# EAGLE design uc4h esc mini v100 (EAGLE 7.5.0)
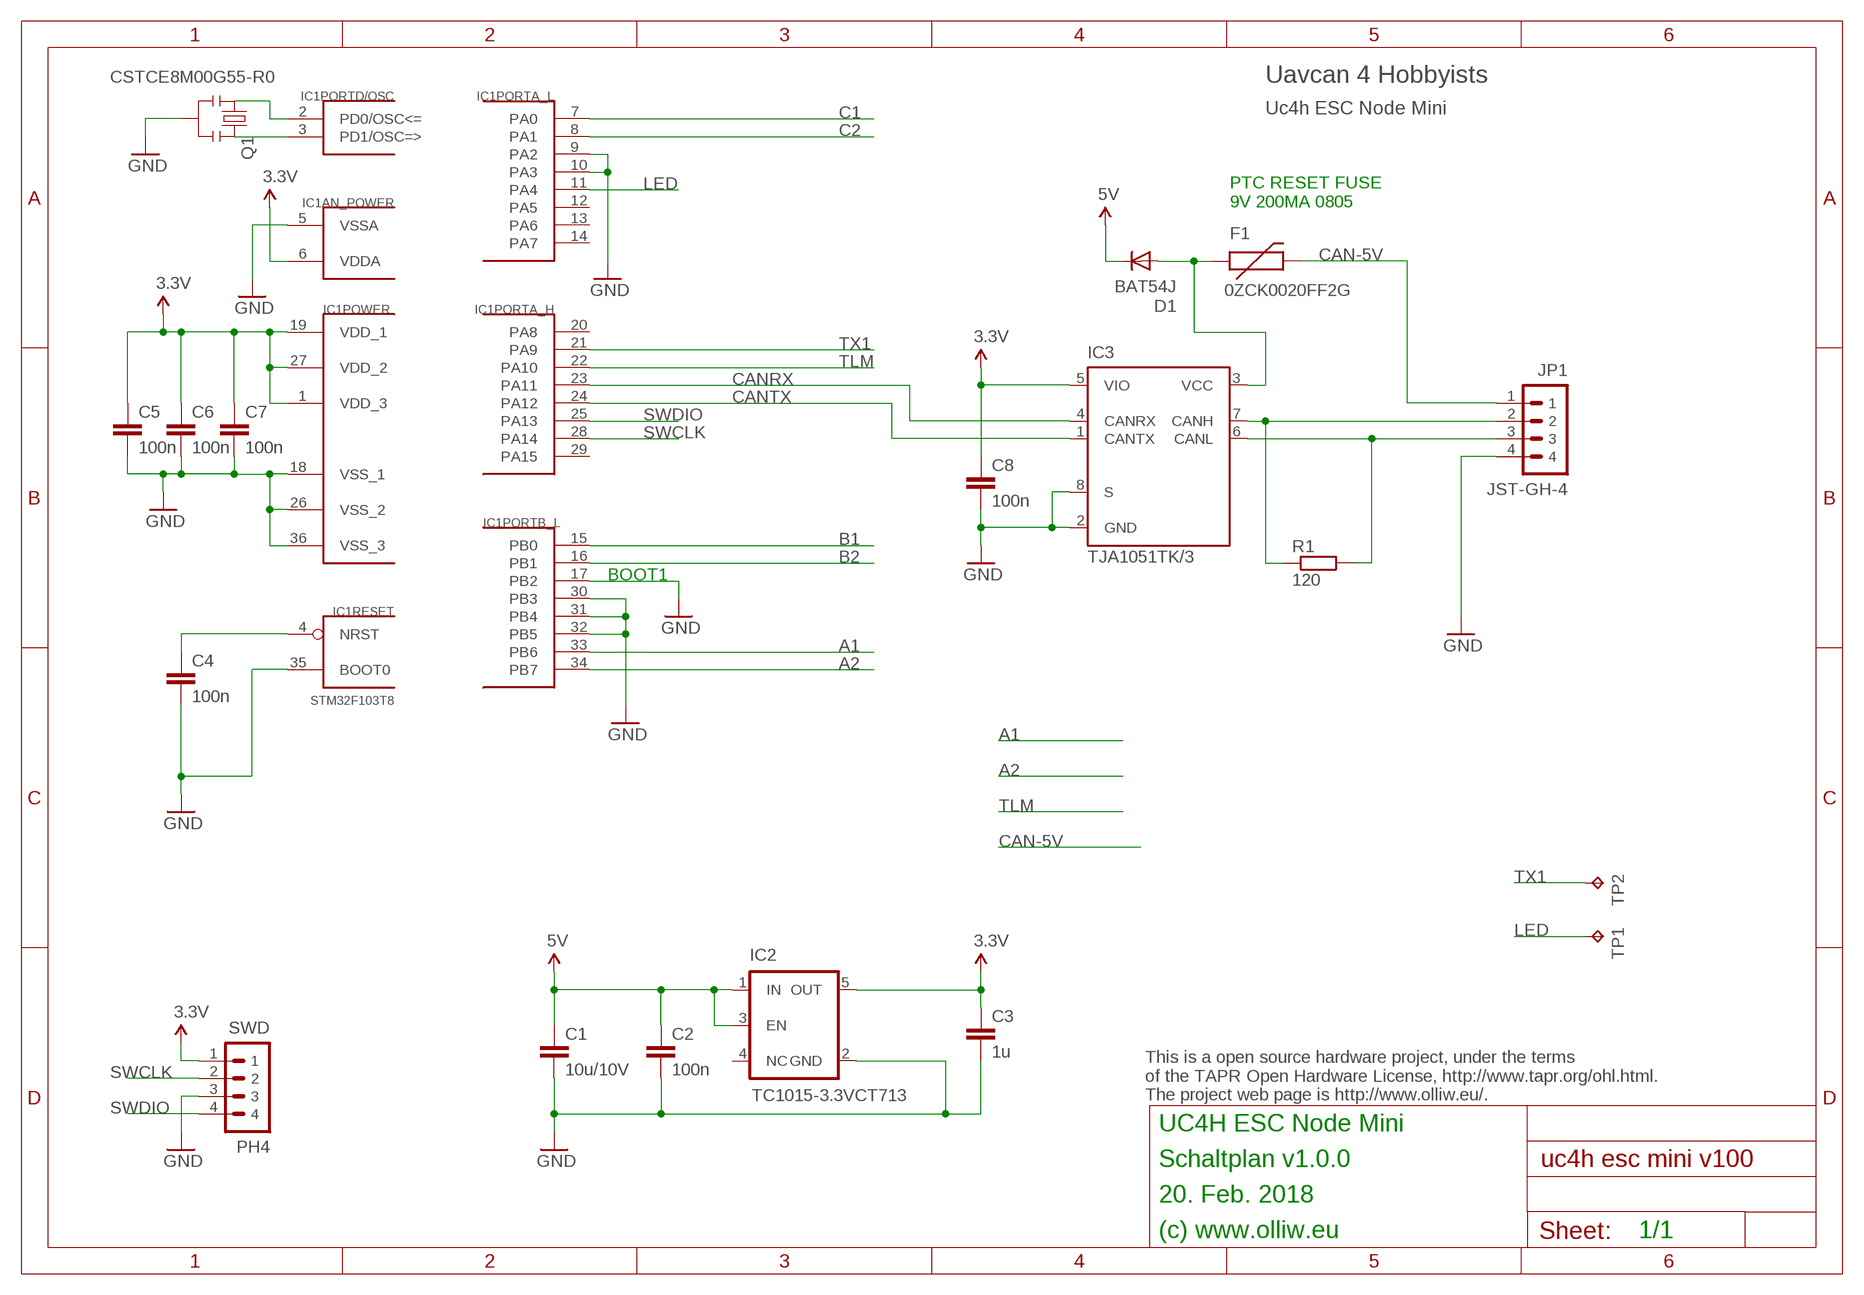
[diagram p0: schematic, sheet 1]

## Parts
C1  10u/10V  C-EUC1206  [C1206]
C2  100n  C-EUC0603K  [C0603K]
C3  1u  C-EUC0603K  [C0603K]
C4  100n  C-EUC0603K  [C0603K]
C5  100n  C-EUC0603K  [C0603K]
C6  100n  C-EUC0603K  [C0603K]
C7  100n  C-EUC0603K  [C0603K]
C8  100n  C-EUC0603K  [C0603K]
D1  BAT54J  DIODE-SOD110-R  [SOD110-R]
F1  0ZCK0020FF2G  FUSE-PTCFUSE-0805  [FUSE-0805]
IC1  STM32F103T8  STM32F10XTXU6  [VFQFPN36]
IC2  TC1015-3.3VCT713  V_REG_TPS76433SOT23-5  [SOT23-5]
IC3  TJA1051TK/3  [HVSON8]
JP1  JST-GH-4  [SM04B-GHS-TB]
Q1  CSTCE8M00G55-R0  RESONATORSMD  [RESONATOR-SMD]
R1  120  R-EU_R0603  [R0603]
SWD  PH4  P4X1_1P27-OCT_BILEX  [4X1_1P27_OCT_BILEX]
TP1  TPB1,27  [B1,27]
TP2  TPB1,27  [B1,27]

## Nets
3.3V: C3.1 C5.1 C6.1 C7.1 C8.1 IC1.1(POWER:VDD_3) IC1.6(AN_POWER:VDDA) IC1.19(POWER:VDD_1) IC1.27(POWER:VDD_2) IC2.5(OUT) IC3.5(VIO) SWD.1
5V: C1.1 C2.1 D1.C IC2.1(IN) IC2.3(EN)
A1: IC1.33(PORTB_L:PB6)
A2: IC1.34(PORTB_L:PB7)
B1: IC1.15(PORTB_L:PB0)
B2: IC1.16(PORTB_L:PB1)
C1: IC1.7(PORTA_L:PA0)
C2: IC1.8(PORTA_L:PA1)
CAN-5V: F1.2 JP1.1
CANH: IC3.7(CANH) JP1.2 R1.1
CANL: IC3.6(CANL) JP1.3 R1.2
CANRX: IC1.23(PORTA_H:PA11) IC3.4(CANRX)
CANTX: IC1.24(PORTA_H:PA12) IC3.1(CANTX)
GND: C1.2 C2.2 C3.2 C4.2 C5.2 C6.2 C7.2 C8.2 IC1.5(AN_POWER:VSSA) IC1.9(PORTA_L:PA2) IC1.10(PORTA_L:PA3) IC1.17(PORTB_L:PB2) IC1.18(POWER:VSS_1) IC1.26(POWER:VSS_2) IC1.30(PORTB_L:PB3) IC1.31(PORTB_L:PB4) IC1.32(PORTB_L:PB5) IC1.35(RESET:BOOT0) IC1.36(POWER:VSS_3) IC2.2(GND) IC3.2(GND) IC3.8(S) JP1.4 Q1.2 SWD.3
LED: IC1.11(PORTA_L:PA4) TP1.TP
N$1: C4.1 IC1.4(RESET:NRST)
N$2: D1.A F1.1 IC3.3(VCC)
N$5: IC1.2(PORTD/OSC:PD0/OSC<=) Q1.1
N$6: IC1.3(PORTD/OSC:PD1/OSC=>) Q1.3
SWCLK: IC1.28(PORTA_H:PA14) SWD.2
SWDIO: IC1.25(PORTA_H:PA13) SWD.4
TLM: IC1.22(PORTA_H:PA10)
TX1: IC1.21(PORTA_H:PA9) TP2.TP
Unconnected: IC1.12(PORTA_L:PA5) IC1.13(PORTA_L:PA6) IC1.14(PORTA_L:PA7) IC1.20(PORTA_H:PA8) IC1.29(PORTA_H:PA15) IC2.4(NC)

## Notes on the sheet
- Uavcan 4 Hobbyists
- Uc4h ESC Node Mini
- PTC RESET FUSE
  9V 200MA 0805
- BOOT1
- This is a open source hardware project, under the terms
  of the TAPR Open Hardware License, http://www.tapr.org/ohl.html.
  The project web page is http://www.olliw.eu/.
- UC4H ESC Node Mini
- Schaltplan v1.0.0
- 20. Feb. 2018
- (c) www.olliw.eu | 1/1

## Library data of the parts
C1-C8 = rcl:C-EU: CAPACITOR, European symbol
D1 = diode:DIODE-: DIODE
F1 = # stdlib:FUSE-PTC
IC1 = # stm32:STM32F10XTXU6: STM32F101/103 36pad VFQPFN36
IC2 = # SparkFun2:V_REG_TPS76433: Voltage Regulator Older TI part. LDO 150mA regulator. No output by-pass cap option. See V_REG_LDO for a better part.
IC3 = # stdlib:TJA1051TK/3
JP1 = # stdlib:JST-GH-4
Q1 = # SparkFun2:RESONATOR: Resonator Small SMD resonator. This is the itty bitty 10/20MHz resonators with built in caps. CSTCE10M0G55 and CSTCE20M0V53. Footprint has been reviewed closely but hasn't been tested yet.
R1 = rcl:R-EU_: RESISTOR, European symbol
SWD = # stdlib:P4X1_1P27
TP1 TP2 = testpad:TP: Test pad

## Board
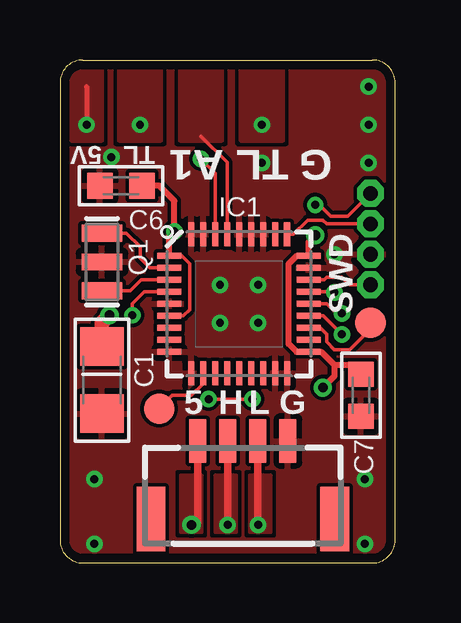
[diagram p1: board, top side]
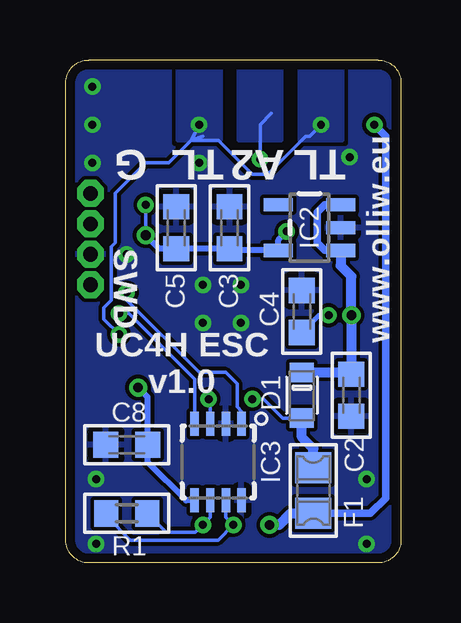
[diagram p2: board, bottom side, seen from below]

Size 13.97 x 20.95 mm. Coordinates in mm from the lower left corner, seen from the top.
Outline: 0.95,20.95 13.02,20.95 arc-90 13.97,20 13.97,0.95 arc-90 13.02,0 0.95,0 arc-90 0,0.95 0,20 arc-90 0.95,20.95
Copper layers (1*16): Top 0.0356mm / dielectric 1.5011mm / Bottom 0.0356mm
Design rules "ow-oshpark-2layer": minimum track width 6mil, minimum drill 13mil, track to track 6mil, track to pad 6mil, pad to pad 6mil, via to via 6mil, smd to smd 6mil, copper to edge 15mil, drill to drill 6mil, minimum pad ring 7mil, minimum via ring 7mil, stop-mask expansion 2.5mil, vias tented up to drill 26mil, thermal gap 10mil

### Footprints (pad centres in the part's own frame; a part is rotated, then mirrored left to right if it is on the bottom)
C1206 = smd 1.6 x 1.8: 1 -1.4,0; 2 1.4,0
C0603K = smd 1.05 x 1.08: 1 -0.875,0; 2 0.875,0
SOD110-R = smd 0.8 x 1: A 0.95,0; C -0.95,0
FUSE-0805 = smd 1.3 x 1.5: 1 -0.95,0; 2 0.95,0
VFQFPN36 = smd 1 x 0.25: 1 -2.9,2; 2 -2.9,1.5; 3 -2.9,1; 4 -2.9,0.5; 5 -2.9,0; 6 -2.9,-0.5; 7 -2.9,-1; 8 -2.9,-1.5; 9 -2.9,-2; 19 2.9,-2; 20 2.9,-1.5; 21 2.9,-1; 22 2.9,-0.5; 23 2.9,0; 24 2.9,0.5; 25 2.9,1; 26 2.9,1.5; 27 2.9,2 | smd 0.25 x 1: 10 -2,-2.9; 11 -1.5,-2.9; 12 -1,-2.9; 13 -0.5,-2.9; 14 0,-2.9; 15 0.5,-2.9; 16 1,-2.9; 17 1.5,-2.9; 18 2,-2.9; 29 1.5,2.9; 30 1,2.9; 31 0.5,2.9; 32 0,2.9; 33 -0.5,2.9; 34 -1,2.9; 35 -1.5,2.9; 36 -2,2.9 | smd 0.27 x 1: 28 2,2.9
SOT23-5 = smd 0.55 x 1.2: 1 -0.95,-1.3; 2 0,-1.3; 3 0.95,-1.3; 4 0.95,1.3; 5 -0.95,1.3
HVSON8 = smd 1 x 0.35: 1 -1.6,0.975; 2 -1.6,0.325; 3 -1.6,-0.325; 4 -1.6,-0.975; 5 1.6,-0.975; 6 1.6,-0.325; 7 1.6,0.325; 8 1.6,0.975
SM04B-GHS-TB = smd 0.7 x 1.8: 1 -1.875,4.6; 2 -0.625,4.6; 3 0.625,4.6; 4 1.875,4.6 | smd 1.2 x 2.7: FIT@1 -3.825,1.35; FIT@2 3.825,1.35
RESONATOR-SMD = smd 0.7 x 1.7: 1 -1.2,0; 2 0,0; 3 1.2,0
R0603 = smd 1 x 1.1: 1 -0.85,0; 2 0.85,0
4X1_1P27_OCT_BILEX = drill 0.61 pad 1.118 octagon: 1 0,0; 2 0,-1.27; 3 0,-2.54; 4 0,-3.81
B1,27 = smd 1.27 x 1.27: TP 0,0

### Placement (x,y rotation side)
C1  1.75,7.62 270 top
C2  2.06,6.99 270 bottom
C3  7.14,13.97 90 bottom
C4  4.13,10.48 90 bottom
C5  9.37,13.97 90 bottom
C6  2.54,15.72 180 top
C7  12.54,6.99 270 top
C8  11.43,4.92 180 bottom
D1  4.13,6.99 270 bottom
F1  3.65,3.02 270 bottom
IC1  7.46,10.79 0 top
IC2  3.81,13.97 90 bottom
IC3  7.62,4.21 270 bottom
JP1  7.62,0.48 0 top
Q1  1.75,12.54 270 top
R1  11.43,2.06 0 bottom
SWD  12.94,15.4 0 top
TP1  4.13,6.43 0 top
TP2  12.94,10 0 top

### Tracks (layer width: path | path; a pad name or v marks a point on that pad's centre or on a via)
3.3V  (via drill 0.33, 0.4)
  Top 0.152: 12.15,8.1 C7.1 12.46,8.26 | IC1.6 5.14,10.29 5.4,10.56 5.4,12.46 5.06,12.79 IC1.1 | SWD.1 11.99,14.45 11.27,14.45 10.79,14.92 v10.64,14.92
  Top 0.254: 11.43,8.26 12.46,8.26 | C6.1 4.13,15.72 4.76,15.08 v4.76,13.81 4.56,13.7 IC1.1 | v10.64,13.65 10.36,13.38 IC1.27 9.86,12.79 9.53,12.46 9.53,9.13 9.86,8.79 IC1.19 10.89,8.79 11.43,8.26 | 11.43,8.26 11.43,7.78 v10.95,7.3
  Bottom 0.152: v10.64,14.92 v10.64,13.65 | C3.1 7.06,13.1 6.99,13.02 7.09,13.02 7.17,13.02
  Bottom 0.254: v10.95,7.3 10.55,6.9 C8.1 10.55,4.21 8.96,2.61 IC3.5 | v10.64,13.65 10.08,13.1 C5.1 C3.1 | 7.17,13.02 IC2.5 5.11,13.46 v4.76,13.81
5V  (via drill 0.4)
  Top 0.61: C1.1 1.75,10 v2.06,10.32
  Bottom 0.152: 1.82,7.93 C2.1 | IC2.1
  Bottom 0.305: IC2.3 3.18,14.92 3.49,14.61 3.49,13.34 3.17,13.02 IC2.1
  Bottom 0.406: D1.C 1.82,7.93 | C2.1 v2.06,10.32 2.06,11.94 2.51,12.38 IC2.1
A1
  Top 0.152: 5.87,17.78 6.96,16.69 IC1.33
  pour Top (isolate 0.254, no thermals): 5,20.64 5,17.62 6.75,17.62 6.75,20.64
A2  (via drill 0.33)
  Top 0.152: IC1.34 6.46,16.24 v5.87,16.83
  Bottom 0.152: v5.87,16.83 5.87,18.26 5.4,18.73
  pour Bottom (isolate 0.254, no thermals): 5,20.64 5,17.62 6.75,17.62 6.75,20.64
CAN-5V  (via drill 0.33, 0.4)
  Top 0.203: 1.11,19.84 v1.11,18.26
  Top 0.305: JP1.1 5.74,1.7 v5.48,1.59
  Bottom 0.152: F1.2
  Bottom 0.305: v1.11,18.26 0.63,17.78 0.63,2.7 1.27,2.06 4.6,2.06
  Bottom 0.406: v5.48,1.59 5.08,1.59 4.6,2.06 F1.2
  pour Top: 5.91,3.65 5.04,3.65 5.04,1.27 5.91,1.27
  pour Top (isolate 0.254, no thermals): 1.75,20.64 0.48,20.64 0.48,17.62 1.75,17.62
CANH  (via drill 0.33)
  Top 0.152: 6.99,1.74 v6.99,1.59
  Top 0.305: JP1.2 6.99,1.74
  Bottom 0.152: IC3.7 7.29,1.9 v6.99,1.59 7.62,0.95 11.27,0.95 12.22,1.91 R1.1
  pour Top: 6.47,3.65 7.34,3.65 7.34,1.27 6.47,1.27
CANL  (via drill 0.33)
  Top 0.152: 8.24,1.58 v8.26,1.59
  Top 0.305: JP1.3 8.24,1.58
  Bottom 0.152: IC3.6 7.94,1.9 v8.26,1.59 8.57,1.27 9.79,1.27 R1.2
  pour Top: 7.9,3.65 8.77,3.65 8.77,1.27 7.9,1.27
CANRX  (via drill 0.33)
  Top 0.152: IC1.23 11.11,10.79 11.51,10.4 v11.75,10.4
  Bottom 0.152: IC3.4 8.6,7.64 11.35,10.4 v11.75,10.4
CANTX  (via drill 0.33)
  Top 0.152: IC1.24 11.41,11.29 v11.43,11.27
  Bottom 0.152: v11.43,11.27 11.43,10.95 8.41,7.94 7.3,7.94 6.83,7.46 6.83,6.51 6.65,6.33 IC3.1
GND  (via drill 0.33)
  other vias: 6.67,11.59 6.67,10 8.26,10 8.26,11.59 11.43,12.86 12.86,19.84 12.86,16.67 12.86,18.26 8.41,16.67 12.7,0.79 1.43,0.79 1.43,3.49 2.14,16.91 12.7,3.49
  pour Bottom (isolate 0.152, rank 6): 0,20.95 13.97,20.95 13.97,0 0,0
  pour Top (isolate 0.152, rank 6): 0,20.95 13.97,20.95 13.97,0 0,0
LED
  Top 0.152: IC1.11 5.96,7.47 5.48,6.99 4.68,6.99 TP1.TP
N$1  (via drill 0.33)
  Top 0.152: IC1.4 3.52,11.29 3.02,10.79 v3.02,10.32
  Bottom 0.203: v3.02,10.32 3.41,10.32 C4.1
N$2  (via drill 0.33)
  Top 0.152: v8.02,6.83 v6.19,6.83
  Bottom 0.152: IC3.3 7.94,6.74 v8.02,6.83 | v6.19,6.83 5.71,6.83 4.92,6.04 D1.A
  Bottom 0.406: F1.1 3.65,4.76 4.13,5.24 D1.A
N$5
  Top 0.152: IC1.2 3.74,12.29 3.33,12.7 3.33,13.18 2.77,13.74 Q1.1
N$6
  Top 0.152: IC1.3 3.38,11.79 2.93,11.34 Q1.3
SWCLK
  Top 0.152: IC1.28 9.73,13.7 10.32,14.29 10.95,14.29 11.11,14.13 SWD.2
SWDIO
  Top 0.152: IC1.25 11,11.79 11.11,11.91 11.75,11.91 12.06,11.59 SWD.4
TLM  (via drill 0.33)
  Top 0.152: IC1.22 10.98,10.29 v11.75,9.53
  Bottom 0.152: v11.75,9.53 12.38,10.16 12.38,10.64 12.06,10.95 12.06,13.18 11.91,13.34 11.91,15.4 10.64,16.67 9.68,16.67 8.73,17.62 | 8.26,17.78 8.73,17.62 | 8.73,17.62 v8.41,18.26 | v3.33,18.26 3.81,17.78 3.97,17.78 5.56,16.19 6.19,16.19 7.62,17.62 8.73,17.62
  pour Top (isolate 0.254, no thermals): 7.54,20.64 7.54,17.62 9.29,17.62 9.29,20.64
  pour Bottom (isolate 0.254, no thermals): 7.54,20.64 7.54,17.62 9.29,17.62 9.29,20.64
  pour Bottom (isolate 0.254, no thermals): 2.46,20.64 2.46,17.62 4.21,17.62 4.21,20.64
  pour Top (isolate 0.254, no thermals): 2.46,20.64 2.46,17.62 4.21,17.62 4.21,20.64
TX1
  Top 0.152: IC1.21 10.84,9.79 11.11,9.53 11.11,9.21 11.43,8.89 12.06,8.89 12.86,9.68 TP2.TP

### Text on the board
tNames: 5V | TL | A1 | TL | G | SWD | 5 | H | L | G
bNames: TL | A2 | TL | G | www.olliw.eu | SWD | UC4H ESC / v1.0